# EAGLE board quantum_AnalougeEngine_V3_0 (EAGLE 9.5.1)
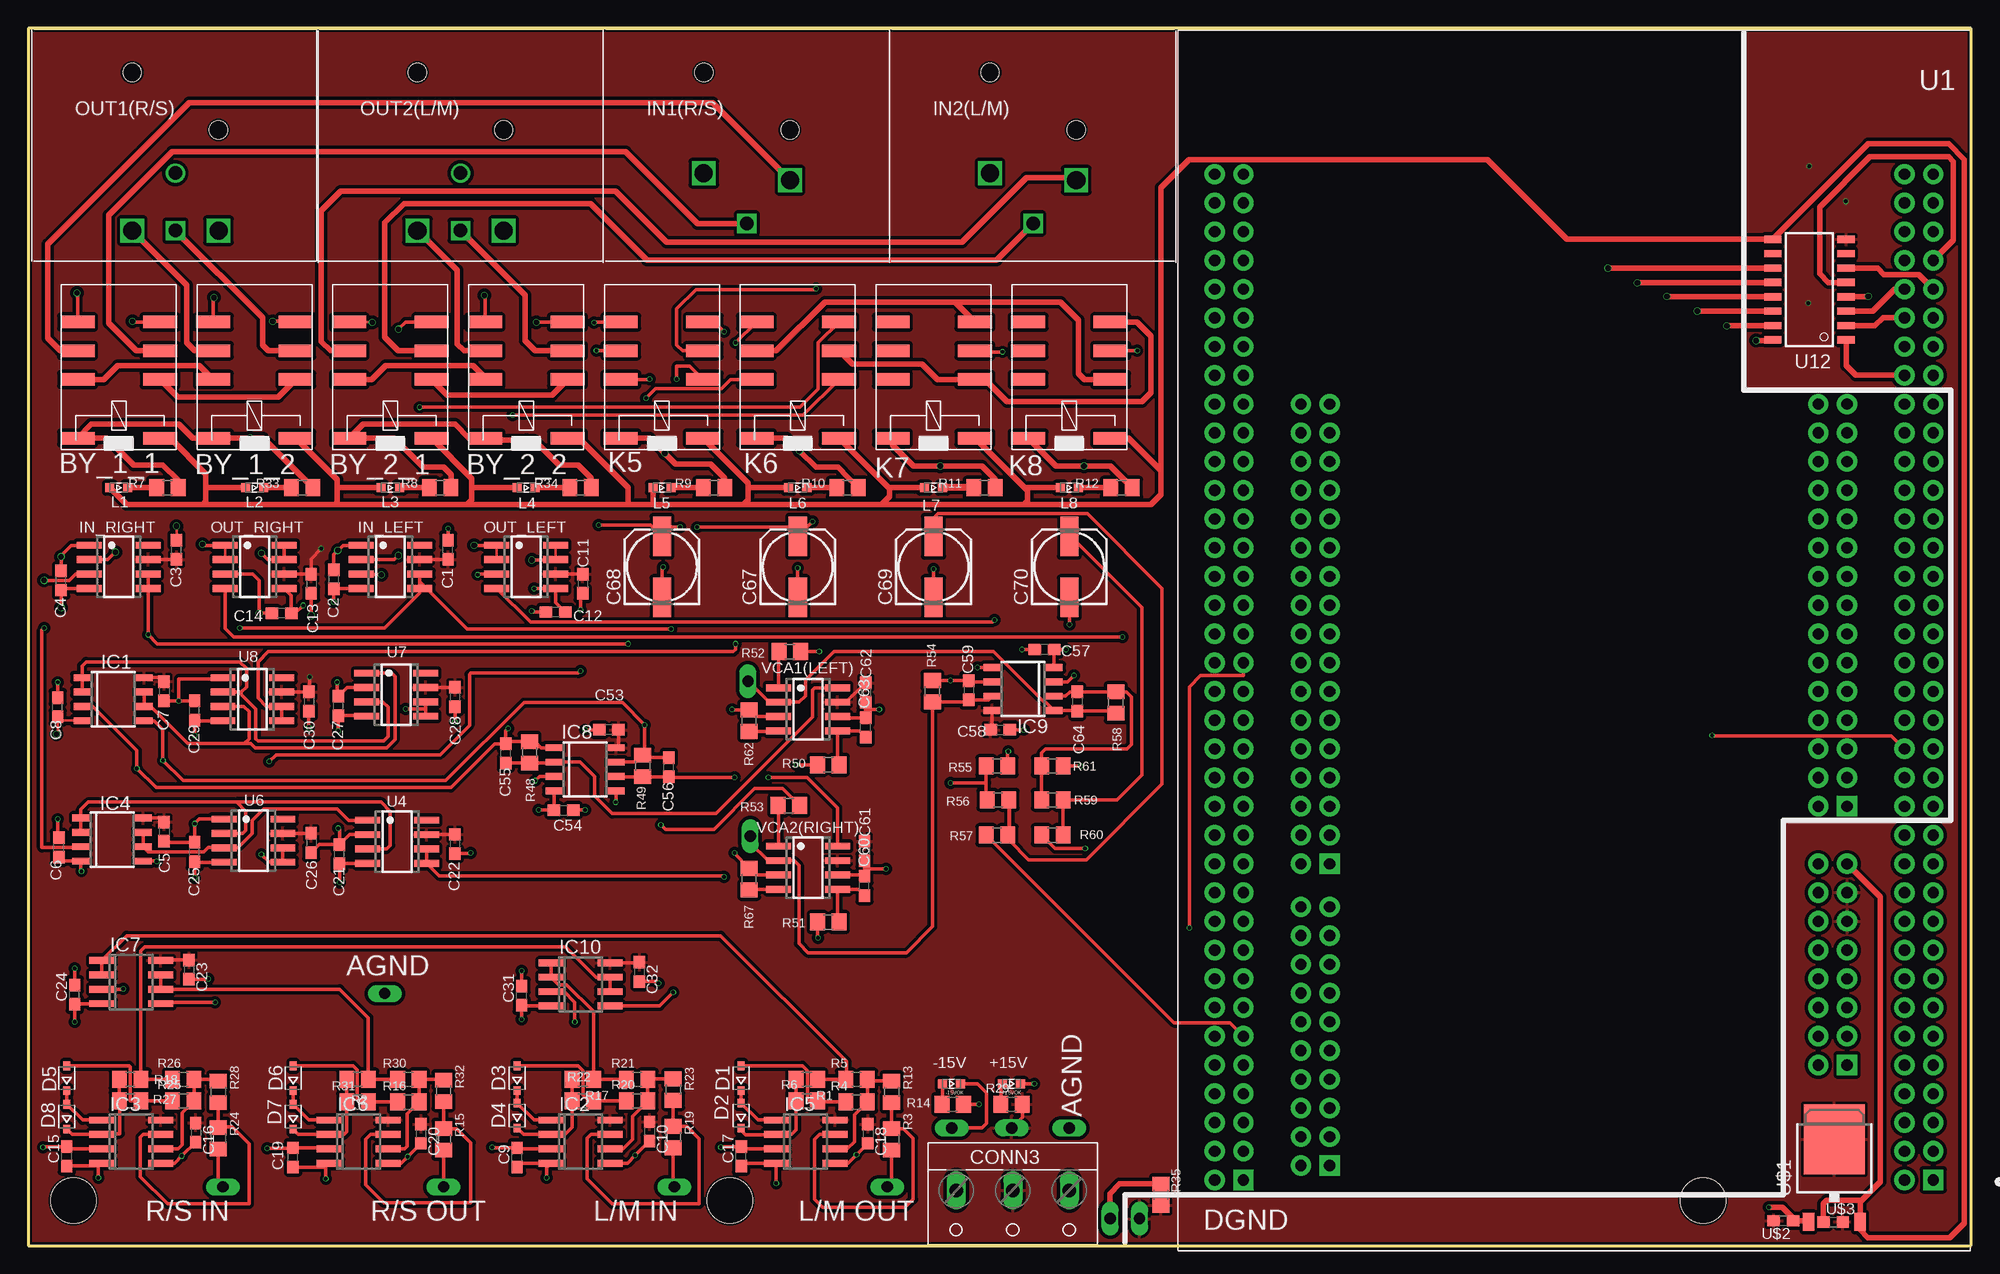
[diagram p10: board, top side]
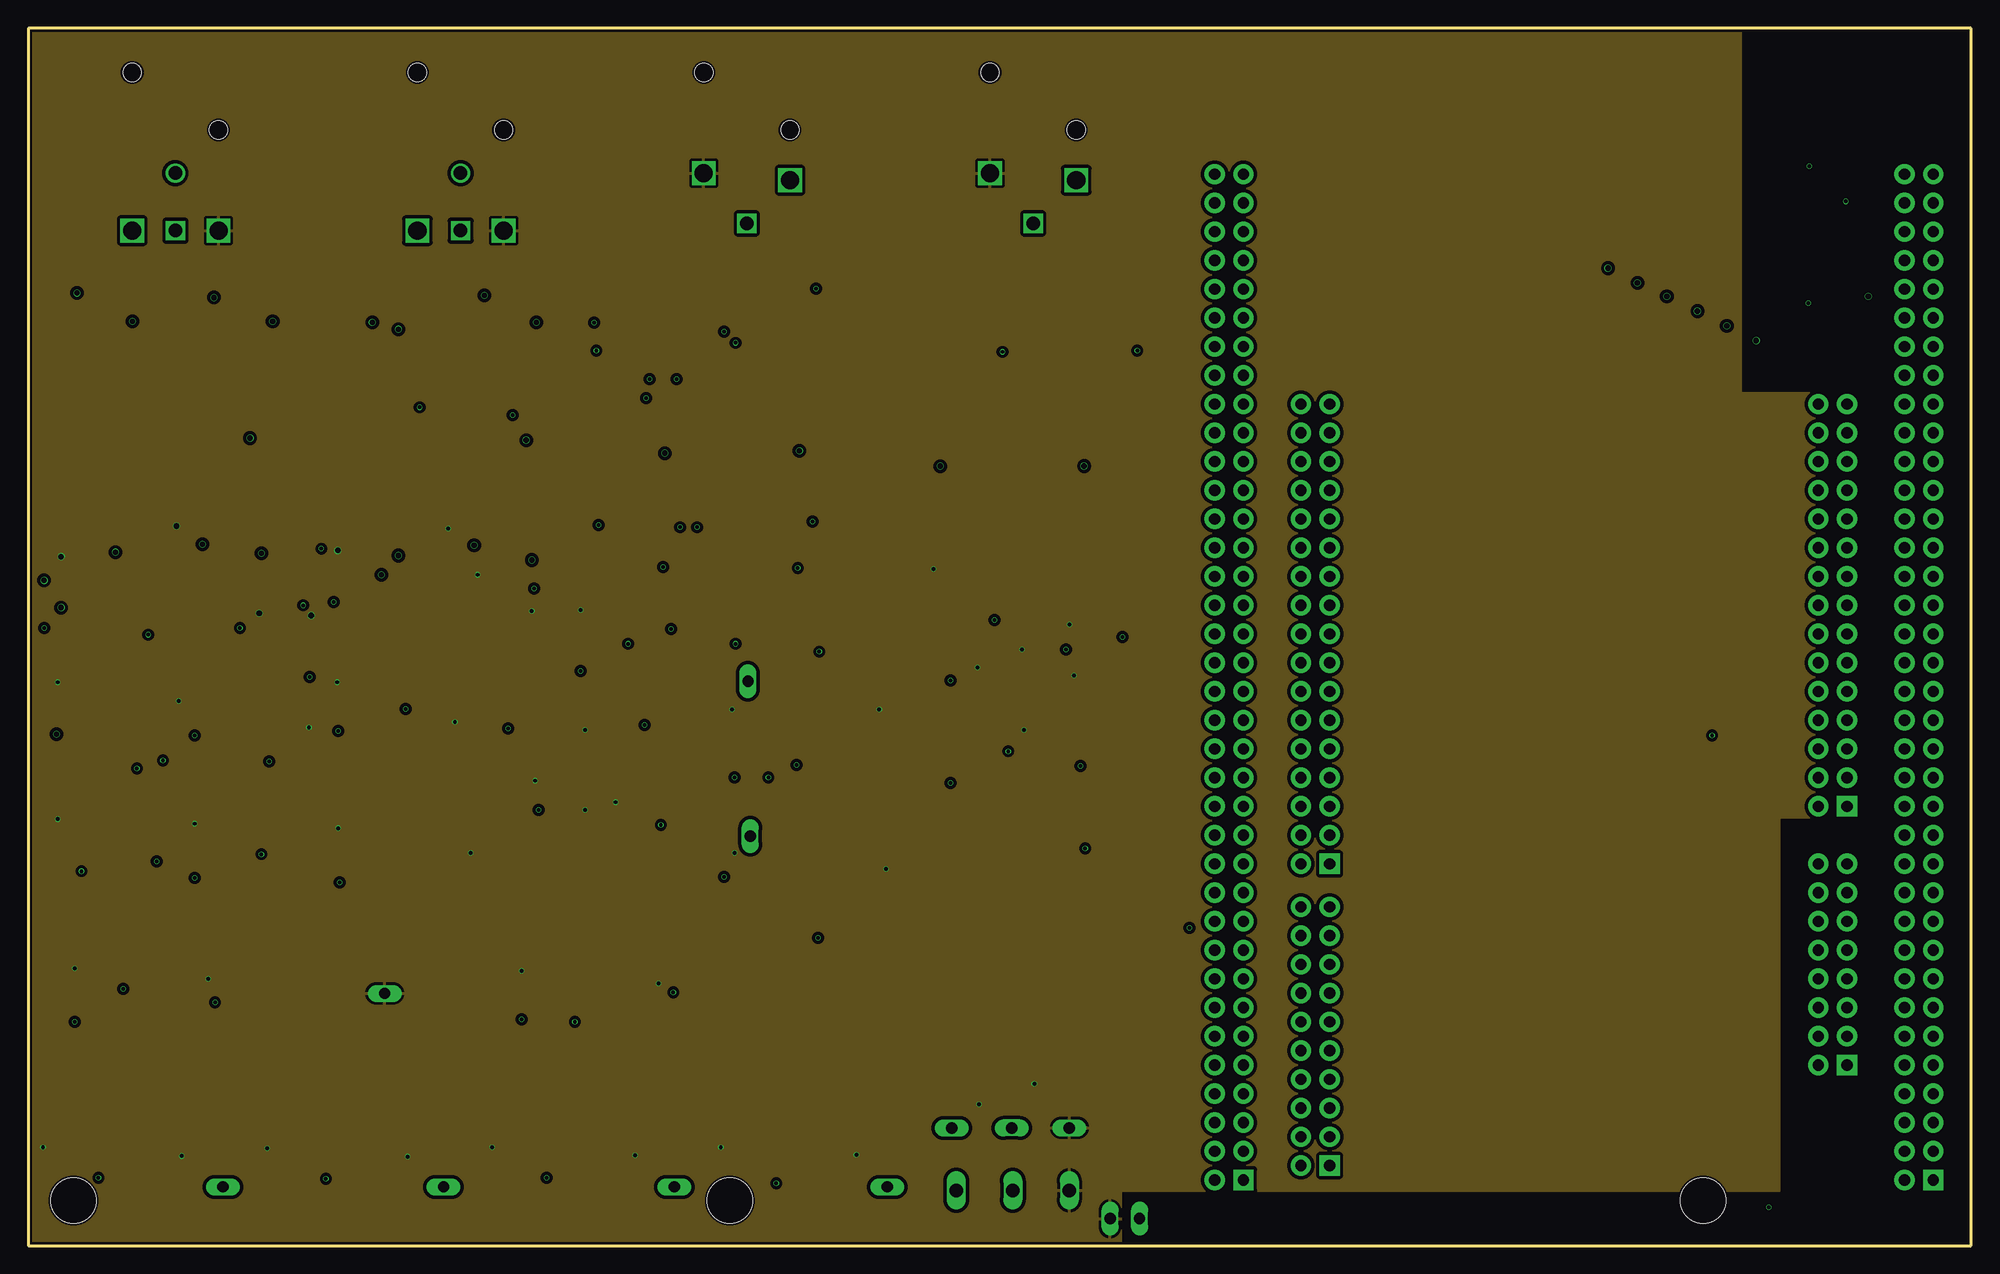
[diagram p11: board, inner layer midTop]
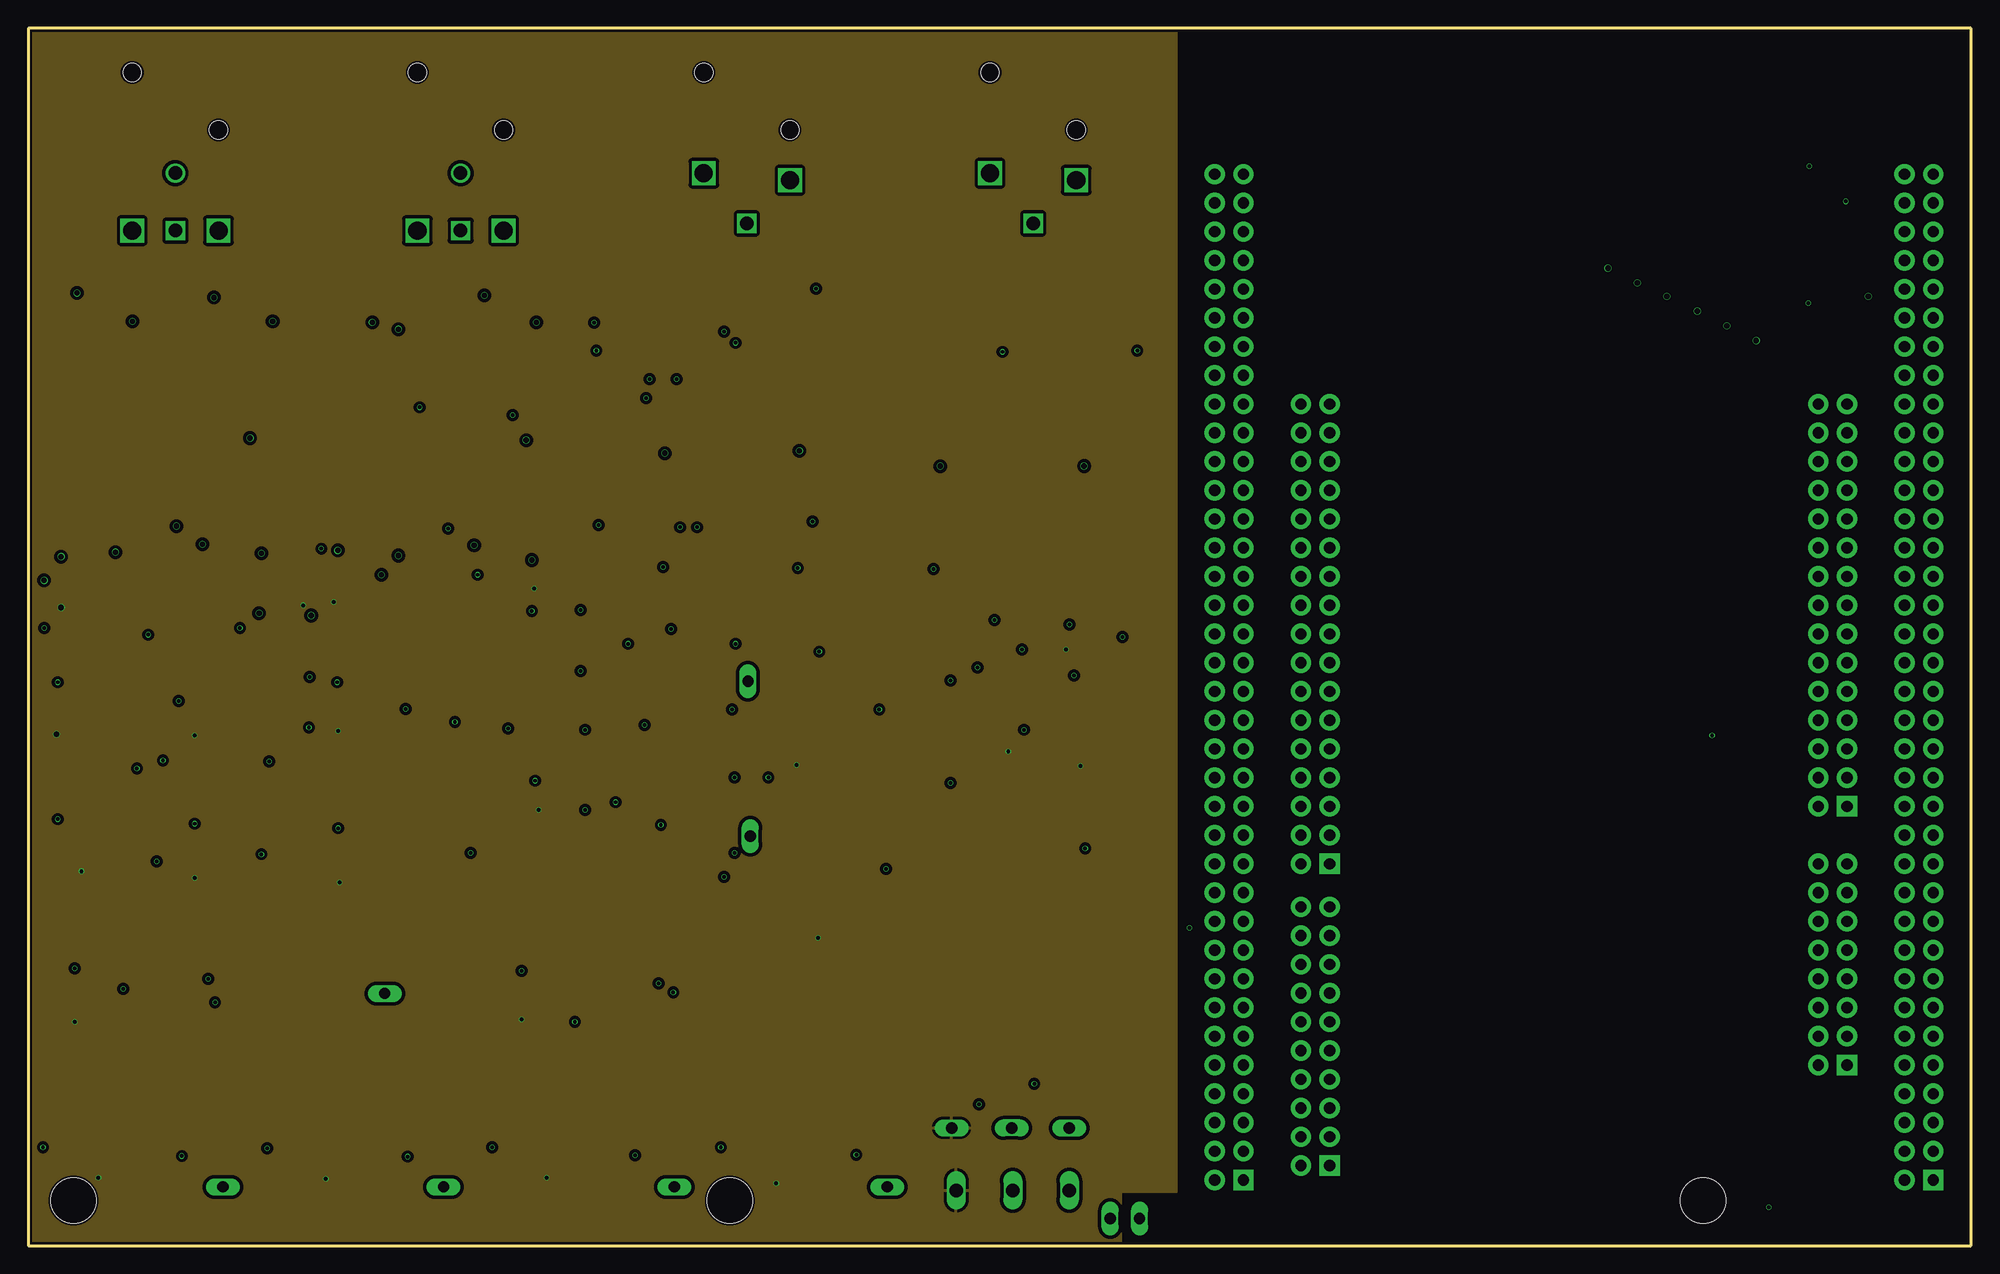
[diagram p12: board, inner layer midBottom]
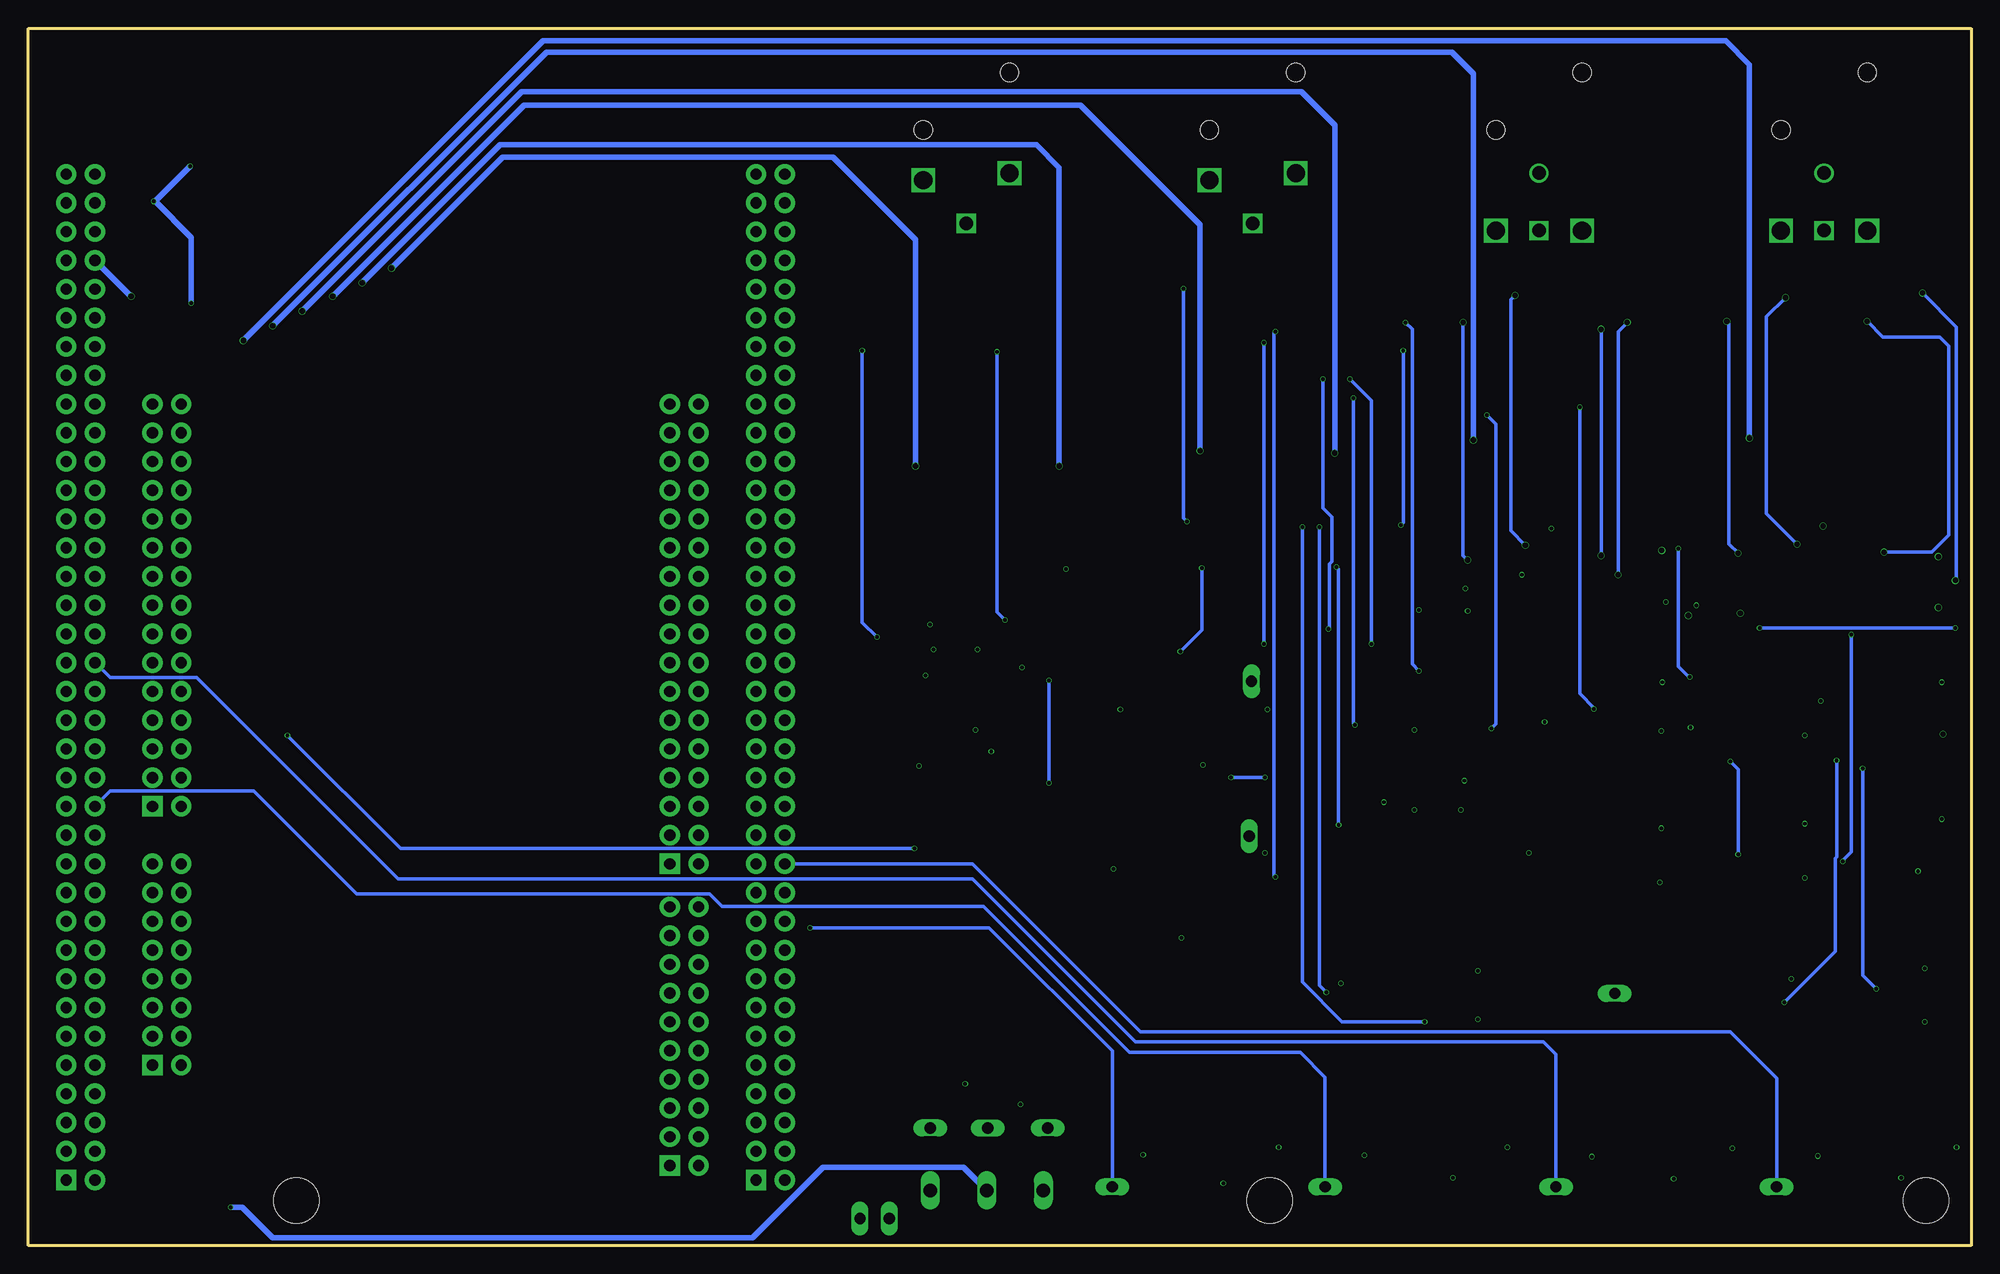
[diagram p13: board, bottom side, seen from below]

Size 171.7 x 107.6 mm. Coordinates in mm from the lower left corner, seen from the top.
Outline: 0,0 171.7,0 171.7,107.6 0,107.6 0,0
Copper layers (1*2+15*16): Top 0.018mm / dielectric 0.362mm / midTop 0.035mm / dielectric 0.71mm / midBottom 0.035mm / dielectric 0.362mm / Bottom 0.018mm
Design rules "4layer *": minimum track width 0.2mm, minimum drill 0.2mm, track to track 0.3mm, track to pad 0.1mm, pad to pad 0.1mm, via to via 0.5mm, smd to smd 0.1mm, copper to edge 0.2mm, drill to drill 0.21mm, minimum pad ring 0.25mm, minimum via ring 0.05mm, stop-mask expansion 0.01mm, vias tented up to drill 0mil, thermal gap 10mil
Holes 4 mm at 4,4 62,4 148,4

## Footprints (pad centres in the part's own frame; a part is rotated, then mirrored left to right if it is on the bottom)
WL-SMCW_0603 = smd 0.8 x 0.8: 1 -0.8,0; 2 0.8,0
351 = smd 1.11 x 3: 1 -2.623,-3.645; 2 -2.623,3.645; P1 5.096,-3.645; P2 5.096,3.645; Q1 2.556,-3.645; Q2 2.556,3.645; S1 7.636,-3.645; S2 7.636,3.645
C0603 = smd 1.1 x 1: 1 -0.85,0; 2 0.85,0
153CLV-0605 = smd 3.5 x 1.6: + 2.7,0; - -2.7,0
W237-103 = drill 1.194 long: 1 -5,-1.29; 2 0,-1.29; 3 5,-1.29
SOD323-R = smd 0.762 x 0.6: A 1.1,0; C -1.1,0
SOIC8 = smd 0.6 x 1.5: 1 -1.905,-2.75; 2 -0.635,-2.75; 3 0.635,-2.75; 4 1.905,-2.75; 5 1.905,2.75; 6 0.635,2.75; 7 -0.635,2.75; 8 -1.905,2.75
SO08 = smd 0.6 x 2.2: 1 -1.905,-2.6; 2 -0.635,-2.6; 3 0.635,-2.6; 4 1.905,-2.6; 5 1.905,2.6; 6 0.635,2.6; 7 -0.635,2.6; 8 -1.905,2.6
NEUTRIK_NC3FAH = drill 1.6 square: 1 -3.81,-12.7; 2 3.81,-13.335 | drill 1.2 square: 3 0,-17.15 | hole 1.6: -3.81,-3.81; 3.81,-8.89
NEUTRIK_NC3MAH = drill 1.6 square: 1 3.81,-17.78; 2 -3.81,-17.78 | drill 1.2 square: 3 0,-17.78 | drill 1.2: G 0,-12.7 | hole 1.6: -3.81,-3.8; 3.81,-8.89
R0805 = smd 1.3 x 1.5: 1 -0.95,0; 2 0.95,0
THT_PIN = drill 1 long: P$1 0,0
MODULE_NUCLEO-F429ZI = drill 1 pad 1.8 square: CN7_1 21.59,43.82; CN8_1 -24.13,34.93; CN9_1 -24.13,12.07; CN10_1 21.59,17.15; CN11_1 -31.75,45.09; CN12_1 29.21,45.09 | drill 1 pad 1.8: CN7_2 24.13,43.82; CN7_3 21.59,41.28; CN7_4 24.13,41.28; CN7_5 21.59,38.74; CN7_6 24.13,38.74; CN7_7 21.59,36.2; CN7_8 24.13,36.2; CN7_9 21.59,33.66; CN7_10 24.13,33.66; CN7_11 21.59,31.12; CN7_12 24.13,31.12; CN7_13 21.59,28.58; CN7_14 24.13,28.58; CN7_15 21.59,26.04; CN7_16 24.13,26.04; CN7_17 21.59,23.5; CN7_18 24.13,23.5; CN7_19 21.59,20.96; CN7_20 24.13,20.96; CN8_2 -21.59,34.93; CN8_3 -24.13,32.39; CN8_4 -21.59,32.39; CN8_5 -24.13,29.85; CN8_6 -21.59,29.85; CN8_7 -24.13,27.31; CN8_8 -21.59,27.31; CN8_9 -24.13,24.77; CN8_10 -21.59,24.77; CN8_11 -24.13,22.23; CN8_12 -21.59,22.23; CN8_13 -24.13,19.69; CN8_14 -21.59,19.69; CN8_15 -24.13,17.15; CN8_16 -21.59,17.15; CN9_2 -21.59,12.07; CN9_3 -24.13,9.53; CN9_4 -21.59,9.53; CN9_5 -24.13,6.99; CN9_6 -21.59,6.99; CN9_7 -24.13,4.45; CN9_8 -21.59,4.45; CN9_9 -24.13,1.91; CN9_10 -21.59,1.91; CN9_11 -24.13,-0.63; CN9_12 -21.59,-0.63; CN9_13 -24.13,-3.17; CN9_14 -21.59,-3.17; CN9_15 -24.13,-5.71; CN9_16 -21.59,-5.71; CN9_17 -24.13,-8.25; CN9_18 -21.59,-8.25; CN9_19 -24.13,-10.79; CN9_20 -21.59,-10.79; CN9_21 -24.13,-13.33; CN9_22 -21.59,-13.33; CN9_23 -24.13,-15.87; CN9_24 -21.59,-15.87; CN9_25 -24.13,-18.41; CN9_26 -21.59,-18.41; CN9_27 -24.13,-20.95; CN9_28 -21.59,-20.95; CN9_29 -24.13,-23.49; CN9_30 -21.59,-23.49; CN10_2 24.13,17.15; CN10_3 21.59,14.61; CN10_4 24.13,14.61; CN10_5 21.59,12.07; CN10_6 24.13,12.07; CN10_7 21.59,9.53; CN10_8 24.13,9.53; CN10_9 21.59,6.99; CN10_10 24.13,6.99; CN10_11 21.59,4.45; CN10_12 24.13,4.45; CN10_13 21.59,1.91; CN10_14 24.13,1.91; CN10_15 21.59,-0.63; CN10_16 24.13,-0.63; CN10_17 21.59,-3.17; CN10_18 24.13,-3.17; CN10_19 21.59,-5.71; CN10_20 24.13,-5.71; CN10_21 21.59,-8.25; CN10_22 24.13,-8.25; CN10_23 21.59,-10.79; CN10_24 24.13,-10.79; CN10_25 21.59,-13.33; CN10_26 24.13,-13.33; CN10_27 21.59,-15.87; CN10_28 24.13,-15.87; CN10_29 21.59,-18.41; CN10_30 24.13,-18.41; CN10_31 21.59,-20.95; CN10_32 24.13,-20.95; CN10_33 21.59,-23.49; CN10_34 24.13,-23.49; CN11_2 -29.21,45.09; CN11_3 -31.75,42.55; CN11_4 -29.21,42.55; CN11_5 -31.75,40.01; CN11_6 -29.21,40.01; CN11_7 -31.75,37.47; CN11_8 -29.21,37.47; CN11_9 -31.75,34.93; CN11_10 -29.21,34.93; CN11_11 -31.75,32.39; CN11_12 -29.21,32.39; CN11_13 -31.75,29.85; CN11_14 -29.21,29.85; CN11_15 -31.75,27.31; CN11_16 -29.21,27.31; CN11_17 -31.75,24.77; CN11_18 -29.21,24.77; CN11_19 -31.75,22.23; CN11_20 -29.21,22.23; CN11_21 -31.75,19.69; CN11_22 -29.21,19.69; CN11_23 -31.75,17.15; CN11_24 -29.21,17.15; CN11_25 -31.75,14.61; CN11_26 -29.21,14.61; CN11_27 -31.75,12.07; CN11_28 -29.21,12.07; CN11_29 -31.75,9.53; CN11_30 -29.21,9.53; CN11_31 -31.75,6.99; CN11_32 -29.21,6.99; CN11_33 -31.75,4.45; CN11_34 -29.21,4.45; CN11_35 -31.75,1.91; CN11_36 -29.21,1.91; CN11_37 -31.75,-0.63; CN11_38 -29.21,-0.63; CN11_39 -31.75,-3.17; CN11_40 -29.21,-3.17; CN11_41 -31.75,-5.71; CN11_42 -29.21,-5.71; CN11_43 -31.75,-8.25; CN11_44 -29.21,-8.25; CN11_45 -31.75,-10.79; CN11_46 -29.21,-10.79; CN11_47 -31.75,-13.33; CN11_48 -29.21,-13.33; CN11_49 -31.75,-15.87; CN11_50 -29.21,-15.87; CN11_51 -31.75,-18.41; CN11_52 -29.21,-18.41; CN11_53 -31.75,-20.95; CN11_54 -29.21,-20.95; CN11_55 -31.75,-23.49; CN11_56 -29.21,-23.49; CN11_57 -31.75,-26.03; CN11_58 -29.21,-26.03; CN11_59 -31.75,-28.57; CN11_60 -29.21,-28.57; CN11_61 -31.75,-31.11; CN11_62 -29.21,-31.11; CN11_63 -31.75,-33.65; CN11_64 -29.21,-33.65; CN11_65 -31.75,-36.19; CN11_66 -29.21,-36.19; CN11_67 -31.75,-38.73; CN11_68 -29.21,-38.73; CN11_69 -31.75,-41.27; CN11_70 -29.21,-41.27; CN11_71 -31.75,-43.81; CN11_72 -29.21,-43.81; CN12_2 31.75,45.09; CN12_3 29.21,42.55; CN12_4 31.75,42.55; CN12_5 29.21,40.01; CN12_6 31.75,40.01; CN12_7 29.21,37.47; CN12_8 31.75,37.47; CN12_9 29.21,34.93; CN12_10 31.75,34.93; CN12_11 29.21,32.39; CN12_12 31.75,32.39; CN12_13 29.21,29.85; CN12_14 31.75,29.85; CN12_15 29.21,27.31; CN12_16 31.75,27.31; CN12_17 29.21,24.77; CN12_18 31.75,24.77; CN12_19 29.21,22.23; CN12_20 31.75,22.23; CN12_21 29.21,19.69; CN12_22 31.75,19.69; CN12_23 29.21,17.15; CN12_24 31.75,17.15; CN12_25 29.21,14.61; CN12_26 31.75,14.61; CN12_27 29.21,12.07; CN12_28 31.75,12.07; CN12_29 29.21,9.53; CN12_30 31.75,9.53; CN12_31 29.21,6.99; CN12_32 31.75,6.99; CN12_33 29.21,4.45; CN12_34 31.75,4.45; CN12_35 29.21,1.91; CN12_36 31.75,1.91; CN12_37 29.21,-0.63; CN12_38 31.75,-0.63; CN12_39 29.21,-3.17; CN12_40 31.75,-3.17; CN12_41 29.21,-5.71; CN12_42 31.75,-5.71; CN12_43 29.21,-8.25; CN12_44 31.75,-8.25; CN12_45 29.21,-10.79; CN12_46 31.75,-10.79; CN12_47 29.21,-13.33; CN12_48 31.75,-13.33; CN12_49 29.21,-15.87; CN12_50 31.75,-15.87; CN12_51 29.21,-18.41; CN12_52 31.75,-18.41; CN12_53 29.21,-20.95; CN12_54 31.75,-20.95; CN12_55 29.21,-23.49; CN12_56 31.75,-23.49; CN12_57 29.21,-26.03; CN12_58 31.75,-26.03; CN12_59 29.21,-28.57; CN12_60 31.75,-28.57; CN12_61 29.21,-31.11; CN12_62 31.75,-31.11; CN12_63 29.21,-33.65; CN12_64 31.75,-33.65; CN12_65 29.21,-36.19; CN12_66 31.75,-36.19; CN12_67 29.21,-38.73; CN12_68 31.75,-38.73; CN12_69 29.21,-41.27; CN12_70 31.75,-41.27; CN12_71 29.21,-43.81; CN12_72 31.75,-43.81
SOIC16 = smd 1.524 x 0.635: 1 -3.24,4.445; 2 -3.24,3.175; 3 -3.24,1.905; 4 -3.24,0.635; 5 -3.24,-0.635; 6 -3.24,-1.905; 7 -3.24,-3.175; 8 -3.24,-4.445; 9 3.24,-4.445; 10 3.24,-3.175; 11 3.24,-1.905; 12 3.24,-0.635; 13 3.24,0.635; 14 3.24,1.905; 15 3.24,3.175; 16 3.24,4.445
TO252 = smd 1 x 1.6: 1 -2.28,-4.8; 3 2.28,-4.8 | smd 5.4 x 6.2: 2 0,2.5

## Placement (x,y rotation side)
+15VOK  SMD_LED_0603  [WL-SMCW_0603]  86.9,14.3 180 top
-15VOK  SMD_LED_0603  [WL-SMCW_0603]  81.6,14.3 180 top
BY_1_1  RELAY_EE2-5NU  [351]  8,74 90 top
BY_1_2  RELAY_EE2-5NU  [351]  20,74 90 top
BY_2_1  RELAY_EE2-5NU  [351]  32,74 90 top
BY_2_2  RELAY_EE2-5NU  [351]  44,74 90 top
C1  100nF  [C0603]  37.1,61.5 90 top
C2  100nF  [C0603]  27,58.9 90 top
C3  100nF  [C0603]  13.1,61.5 90 top
C4  100nF  [C0603]  2.9,58.8 90 top
C5  100nF  [C0603]  12,36.6 270 top
C6  100nF  [C0603]  2.7,35.2 90 top
C7  100nF  [C0603]  12,49 270 top
C8  100nF  [C0603]  2.6,47.6 90 top
C9  100nF  [C0603]  43.2,7.8 90 top
C10  100nF  [C0603]  54.9,10.1 270 top
C11  100nF  [C0603]  49,58.5 270 top
C12  100nF  [C0603]  46.6,56 180 top
C13  100nF  [C0603]  25,58.5 270 top
C14  100nF  [C0603]  22.4,55.9 180 top
C15  100nF  [C0603]  3.4,7.9 90 top
C16  100nF  [C0603]  14.8,10 270 top
C17  100nF  [C0603]  63,7.9 90 top
C18  100nF  [C0603]  74.2,9.9 270 top
C19  100nF  [C0603]  23.4,7.8 90 top
C20  100nF  [C0603]  34.7,9.9 270 top
C21  100nF  [C0603]  27.5,34.6 90 top
C22  100nF  [C0603]  37.7,35.5 270 top
C23  100nF  [C0603]  14.2,24.4 270 top
C24  100nF  [C0603]  4.1,22.2 90 top
C25  100nF  [C0603]  14.7,34.8 90 top
C26  100nF  [C0603]  25,35.6 270 top
C27  100nF  [C0603]  27.4,47.7 90 top
C28  100nF  [C0603]  37.7,48.5 270 top
C29  100nF  [C0603]  14.7,47.3 90 top
C30  100nF  [C0603]  24.8,48.1 270 top
C31  100nF  [C0603]  43.6,22.1 90 top
C32  100nF  [C0603]  54,24.2 270 top
C53  100nF  [C0603]  51.3,45.6 180 top
C54  100nF  [C0603]  47.3,38.5 0 top
C55  22pF  [C0603]  42.2,43.5 90 top
C56  22pF  [C0603]  56.6,42.3 90 top
C57  100nF  [C0603]  89.8,52.7 180 top
C58  100nF  [C0603]  85.9,45.6 0 top
C59  100nF  [C0603]  83.1,49.1 270 top
C60  100nF  [C0603]  73.9,31.8 90 top
C61  100nF  [C0603]  73.9,34.9 270 top
C62  100nF  [C0603]  74,48.9 270 top
C63  100nF  [C0603]  74,45.8 90 top
C64  100nF  [C0603]  92.7,48.1 270 top
C67  47µF  [153CLV-0605]  68,60 90 top
C68  47µF  [153CLV-0605]  56,60 90 top
C69  2.2µF  [153CLV-0605]  80,60 90 top
C70  2.2µF  [153CLV-0605]  92,60 90 top
CONN3  [W237-103]  87,3.6 180 top
D1  4148  [SOD323-R]  63,14.8 90 top
D2  4148  [SOD323-R]  63,11.5 90 top
D3  4148  [SOD323-R]  43.2,14.8 90 top
D4  4148  [SOD323-R]  43.2,11.5 90 top
D5  4148  [SOD323-R]  3.4,14.8 90 top
D6  4148  [SOD323-R]  23.4,14.8 90 top
D7  4148  [SOD323-R]  23.4,11.4 90 top
D8  4148  [SOD323-R]  3.4,11.4 90 top
IC1  OP275  [SOIC8]  7.5,48.3 270 top
IC2  NE5532D  [SO08]  48.8,9.2 270 top
IC3  NE5532D  [SO08]  9.1,9.2 270 top
IC4  OP275  [SOIC8]  7.4,35.9 270 top
IC5  NE5532D  [SO08]  68.7,9.2 270 top
IC6  NE5532D  [SO08]  29.2,9.2 270 top
IC7  NE5532D  [SO08]  9.1,23.3 270 top
IC8  OP275  [SOIC8]  49.2,42.1 270 top
IC9  TL072  [SOIC8]  87.9,49.2 90 top
IC10  NE5532D  [SO08]  48.8,23.1 270 top
IN1(R/S)  NEUTRIK_NC3FAH  [NEUTRIK_NC3FAH]  63.5,107.5 0 top
IN2(L/M)  NEUTRIK_NC3FAH  [NEUTRIK_NC3FAH]  88.8,107.5 0 top
IN_LEFT  1240  [SO08]  32,60 270 top
IN_RIGHT  1240  [SO08]  8,60 270 top
K5  RELAY_EE2-5NU  [351]  56,74 90 top
K6  RELAY_EE2-5NU  [351]  68,74 90 top
K7  RELAY_EE2-5NU  [351]  80,74 90 top
K8  RELAY_EE2-5NU  [351]  92,74 90 top
L1  SMD_LED_0603  [WL-SMCW_0603]  8,67 180 top
L2  SMD_LED_0603  [WL-SMCW_0603]  20,67 180 top
L3  SMD_LED_0603  [WL-SMCW_0603]  32,67 180 top
L4  SMD_LED_0603  [WL-SMCW_0603]  44,67 180 top
L5  SMD_LED_0603  [WL-SMCW_0603]  56,67 180 top
L6  SMD_LED_0603  [WL-SMCW_0603]  68,67 180 top
L7  SMD_LED_0603  [WL-SMCW_0603]  80,67 180 top
L8  SMD_LED_0603  [WL-SMCW_0603]  92,67 180 top
OUT1(R/S)  NEUTRIK_NC3MAH  [NEUTRIK_NC3MAH]  13,107.5 0 top
OUT2(L/M)  NEUTRIK_NC3MAH  [NEUTRIK_NC3MAH]  38.2,107.5 0 top
OUT_LEFT  1646  [SO08]  44,60 270 top
OUT_RIGHT  1646  [SO08]  20,60 270 top
R1  100k  [R0805]  68.8,14.7 180 top
R2  100k  [R0805]  29.1,14.7 180 top
R3  0R  [R0805]  76.3,9.4 270 top
R4  100k  [R0805]  73.2,12.7 0 top
R5  180k  [R0805]  73.2,14.7 0 top
R6  100k  [R0805]  68.8,12.8 0 top
R7  500R  [R0805]  12.3,67 180 top
R8  500R  [R0805]  36.4,67 180 top
R9  500R  [R0805]  60.6,67 180 top
R10  500R  [R0805]  72.4,67 180 top
R11  500R  [R0805]  84.5,67 180 top
R12  500R  [R0805]  96.6,67 180 top
R13  100k  [R0805]  76.3,13.6 270 top
R14  0R  [R0805]  81.7,12.5 0 top
R15  0R  [R0805]  36.7,9.4 270 top
R16  100k  [R0805]  33.6,12.7 0 top
R17  100k  [R0805]  49,14.7 180 top
R18  100k  [R0805]  9,14.7 180 top
R19  0R  [R0805]  57,9.6 270 top
R20  100k  [R0805]  53.8,12.8 0 top
R21  180k  [R0805]  53.8,14.7 0 top
R22  100k  [R0805]  49,12.8 0 top
R23  100k  [R0805]  57,13.8 270 top
R24  0R  [R0805]  16.8,9.5 270 top
R25  100k  [R0805]  13.7,12.8 0 top
R26  180k  [R0805]  13.7,14.7 0 top
R27  100k  [R0805]  9,12.8 0 top
R28  100k  [R0805]  16.8,13.6 270 top
R29  0R  [R0805]  86.9,12.5 0 top
R30  180k  [R0805]  33.6,14.7 0 top
R31  100k  [R0805]  29.1,12.7 0 top
R32  100k  [R0805]  36.7,13.7 270 top
R33  500R  [R0805]  24.2,67 180 top
R34  500R  [R0805]  48.8,67 180 top
R35  0R  [R0805]  100.1,4.5 270 top
R48  20k  [R0805]  44.3,43.6 90 top
R49  20k  [R0805]  54.3,42.4 90 top
R50  5k1  [R0805]  70.7,42.5 0 top
R51  5k1  [R0805]  70.7,28.6 0 top
R52  20k  [R0805]  67.3,52.5 180 top
R53  20k  [R0805]  67.2,38.9 180 top
R54  2k00  [R0805]  79.9,49 270 top
R55  178k  [R0805]  85.6,42.4 180 top
R56  6k49  [R0805]  85.7,39.4 180 top
R57  6k34  [R0805]  85.6,36.3 0 top
R58  2k00  [R0805]  96.1,48 270 top
R59  6k49  [R0805]  90.5,39.4 180 top
R60  6k34  [R0805]  90.5,36.3 0 top
R61  178k  [R0805]  90.5,42.4 180 top
R62  51R  [R0805]  63.7,46.4 90 top
R67  51R  [R0805]  63.7,32.4 90 top
TP01  TPTHT  [THT_PIN]  57.1,5.2 0 top
TP02  TPTHT  [THT_PIN]  17.2,5.2 0 top
TP03  TPTHT  [THT_PIN]  75.9,5.2 0 top
TP04  TPTHT  [THT_PIN]  36.7,5.2 0 top
TP05  TPTHT  [THT_PIN]  98.2,2.4 90 top
TP06  TPTHT  [THT_PIN]  92,10.4 0 top
TP09  TPTHT  [THT_PIN]  86.9,10.4 180 top
TP16  TPTHT  [THT_PIN]  31.5,22.3 0 top
TP18  TPTHT  [THT_PIN]  95.6,2.4 90 top
TP23  TPTHT  [THT_PIN]  81.6,10.4 0 top
TP36  TPTHT  [THT_PIN]  63.8,36.2 90 top
TP37  TPTHT  [THT_PIN]  63.6,49.9 90 top
U1  NUCLEO-F429ZI  [MODULE_NUCLEO-F429ZI]  136.6,50.9 180 top
U4  THAT1240  [SO08]  32.6,35.7 270 top
U6  THAT1240  [SO08]  19.9,35.8 270 top
U7  THAT1240  [SO08]  32.5,48.7 270 top
U8  THAT1240  [SO08]  19.8,48.3 270 top
U12  ULN2003  [SOIC16]  157.4,84.5 180 top
U$1  7809  [TO252]  159.6,6.9 0 top
U$2  [C0603]  155.1,2.2 180 top
U$3  [C0603]  159.5,2.1 0 top
VCA1(LEFT)  THAT2181S  [SO08]  68.9,47.4 270 top
VCA2(RIGHT)  THAT2181S  [SO08]  68.9,33.4 270 top

## Tracks (layer width: path | path; a pad name or v marks a point on that pad's centre or on a via)
+9V
  Top 0.508: L1.2 8.7,65.5 15.4,65.5 | 15.4,65.5 15.7,65.8 15.7,67.1 | 15.7,67.1 15.7,68.2 12.52,71.38 BY_1_1.1 | L2.2 15.8,67 15.7,67.1 | BY_1_2.1 27.3,67.72 27.3,67 | 27.3,67 27.3,65.7 27.1,65.5 | 27.1,65.5 15.4,65.5 | L3.2 27.3,67 | 27.1,65.5 38.8,65.5 | 38.8,65.5 39.2,65.9 39.2,67 | 39.2,67 39.2,67.82 BY_2_1.1 | L4.2 39.2,67 | 38.8,65.5 53,65.5 | 53,65.5 55.2,65.5 | 55.2,65.5 63.2,65.5 | BY_2_2.1 48.65,71.38 53.02,67 53.02,65.52 53,65.5 | 63.2,65.5 63.6,65.9 63.6,67.1 | 63.6,67.1 63.6,67.42 K5.1 | L6.2 63.7,67 63.6,67.1 | 63.2,65.5 75.4,65.5 | 75.4,65.5 88,65.5 | 88,65.5 88.3,65.8 88.3,66.72 88.02,67 | 88.02,67 K7.1 | L8.2 88.02,67 | 88,65.5 99.2,65.5 100.1,66.4 100.1,68.5 | K8.1 97.22,71.38 100.1,68.5 | U$1.3 161.88,1.4 162.58,0.7 169.8,0.7 171.1,2 171.1,96 169.7,97.4 162.62,97.4 U12.9 135.96,88.94 128.94,95.96 102.56,95.96 100.1,93.5 100.1,68.5 | U$1.3 161.88,4 158.95,4 158.65,3.7 U$3.1 | U1.CN8_15 163.65,30.83 163.65,5.67 161.88,3.9 U$1.3 | L7.2 76.1,67 | 76.1,67 76.02,67 K6.1 | 76.1,67 76.1,66.2 75.4,65.5 | L5.2 55.2,65.5
ADC1-IN0
  Top 0.305: R19.2 57,5.3 TP01.P$1
  Bottom 0.305: TP01.P$1 57.1,14.9 59.3,17.1 74.4,17.1 87.3,30 110.4,30 111.49,31.09 142.69,31.09 151.8,40.2 164.44,40.2 U1.CN11_28
ADC1-IN3  (via drill 0.35)
  Top 0.305: R3.2 76.3,5.6 TP03.P$1 | v102.6,28.1 102.6,49.4 103.58,50.38 107.39,50.38 U1.CN12_37
  Bottom 0.305: TP03.P$1 75.9,17.2 86.8,28.1 v102.6,28.1
ADC2-IN9
  Top 0.305: TP02.P$1 16.8,5.6 R24.2
  Bottom 0.305: TP02.P$1 17.2,14.8 21.3,18.9 73.4,18.9 88.25,33.75 U1.CN12_24
ADC2-IN10
  Top 0.305: R15.2 TP04.P$1
  Bottom 0.305: TP04.P$1 36.7,16.9 37.8,18 73.85,18 85.48,29.62 85.58,29.72 88.25,32.4 139,32.4 156.8,50.2 164.48,50.2 U1.CN11_38
AGND  (via drill 0.35, 0.5)
  Top 0.203: 2.9,61 v2.9,60.9 | C3.2 v13.1,63.6
  Top 0.305: C4.2 v2.9,60.9 | IN_RIGHT.1 3.81,61.91 2.9,61 | C2.2 27,61.1 v27.35,61.45 27.8,61.91 IN_LEFT.1 | OUT_RIGHT.3 19.84,59.37 20.4,58.8 v20.4,55.9 C14.2 | C13.2 v25,55.7 | C1.2 v37.1,63.4 | OUT_LEFT.3 39.77,59.37 v39.7,59.3 | C11.2 48.8,57.45 v48.8,56.2 | C12.2 44.6,56 v44.5,56.1 | VCA1(LEFT).3 64.28,46.77 R62.2 62.25,47.35 v62.2,47.4 | VCA1(LEFT).6 71.61,46.65 C63.2 74,47.4 | 74,47.4 C62.2 | 74,47.4 v75.2,47.4 | C58.2 v88,45.6 | IC9.3 91.83,49.84 v92.4,50.4 | C57.2 v87.8,52.7 | IC9.5 v83.9,51.1 | C70.- v92,54.9 | C69.- v80,59.8 | IC8.3 45.16,41.47 v44.8,41.1 | C54.2 v49.2,38.5 | IC8.5 51.95,39.25 v51.9,39.2 | C53.2 v49.2,45.6 | C8.2 v2.6,49.8 | C7.2 v13.3,48.15 | v13.3,48.15 C29.2 | U8.1 17.09,50.1 13.3,50.1 v13.3,48.15 | C6.2 2.6,36.15 v2.6,37.7 | U6.1 15.11,37.7 v14.7,37.3 C25.2 12.1,35.65 C5.2 | C30.2 v24.8,45.8 | v27.3,49.8 27.3,48.65 C27.2 28.18,49.34 U7.2 | C28.2 v37.7,46.3 | C21.2 28.39,36.34 U4.2 | C21.2 27.5,36.8 v27.4,36.9 | C22.2 39.05,34.65 v39.1,34.7 | C23.2 15.85,23.55 v15.9,23.6 | C24.2 v4.1,24.5 | C31.2 v43.6,24.3 | C32.2 55.55,23.35 v55.7,23.2 | C26.2 25.7,35.45 C21.2 | VCA2(RIGHT).6 73.78,32.77 C60.2 C61.2 73.9,33.3 v75.8,33.3 | VCA2(RIGHT).3 64.28,32.77 R67.2 62.4,34.65 v62.4,34.7 | IC3.3 3.58,8.56 C15.2 1.35,8.75 v1.3,8.7 | IC3.5 12.95,7.29 v13.57,7.92 C16.2 | IC6.3 26.52,8.65 C19.2 23.35,8.6 v21.1,8.6 | IC6.5 32.95,7.29 v33.52,7.88 C20.2 | IC2.3 43.28,8.56 C9.2 41.05,8.65 v41,8.7 | IC2.5 52.95,7.29 v53.62,7.97 C10.2 | IC5.3 63.19,8.56 C17.2 61.25,8.75 v61.2,8.7 | IC5.5 72.44,7.29 v73.17,8.03 C18.2 | +15VOK.1 v88.9,14.3 | v84,12.5 R14.2
  Top 0.508: R35.1 96.45,5.45 95.6,4.6 TP18.P$1
  pour midTop: 151.4,108.3 151.4,75.4 169.6,75.4 169.6,37.8 154.8,37.8 154.8,4.8 96.6,4.8 96.6,-1 -0.3,-1 -0.3,108.3
DAC_OUT1  (via drill 0.35)
  Top 0.305: R60.1 90.75,35.1 v93.4,35.1 | v148.8,45.1 148.84,45.06 164.66,45.06 U1.CN11_32
  Bottom 0.305: v93.4,35.1 138.8,35.1 v148.8,45.1
DAC_OUT2
  Top 0.305: R57.1 101.25,19.7 106.2,19.7 U1.CN12_11
DGND  (via drill 0.35)
  Bottom 0.508: v157.4,95.4 160.5,92.3 | 160.5,92.3 v160.6,92.3 | v157.3,83.3 157.3,89.1 160.5,92.3
  pour Top: 151.9,108.3 151.9,75.9 170.1,75.9 170.1,37.4 155.3,37.4 155.3,4.3 97.2,4.3 97.2,-1 172.7,-1 172.7,108.3
L  (via drill 0.35)
  Top 0.305: IN_LEFT.6 34.6,58.7 | 34.6,58.7 IN_LEFT.5 34.6,57.7 31.5,54.6 v18.7,54.6 | v57.3,76.6 57.3,77.74 58.46,77.74 K5.Q1 | v56.8,54.5 38.8,54.5 34.6,58.7 | IC4.3 4.58,35.2 1.2,35.2 1.2,54.4 v1.4,54.6
  Bottom 0.305: v57.3,76.6 57.3,65.2 56.5,64.4 56.5,60.45 56.7,60.25 56.7,54.59 v56.8,54.5 | v1.4,54.6 10.35,54.6 v18.7,54.6
L/M_IN(VCA1_IN)  (via drill 0.35)
  Top 0.305: K5.P1 57.8,79.1 57.3,79.6 57.3,82.8 59,84.5 69.6,84.5 v69.6,84.6 | v69.3,64 C67.+ 67.2,63.5 v59.1,63.5 | v48.3,19.8 48.3,21.5 47.34,22.46 IC10.3
  Bottom 0.305: v69.6,84.6 69.6,64.3 v69.3,64 | v59.1,63.5 59.1,23.3 55.6,19.8 v48.3,19.8
L/M_OUT(VCA1_OUT)  (via drill 0.35)
  Top 0.305: K6.Q1 68.49,73.4 v42.8,73.4 | v42.4,45.7 42.2,45.5 C55.2 | C55.2 42.4,44.55 R48.2 44.75,44.55 45.3,44 IC8.1 | IC1.3 5.69,47.66 9.6,43.75 v9.6,42.2 11.3,40.49 37.35,40.49 41.2,44.35 C55.2 | v8.4,22.7 8.37,22.66 IC7.3
  Bottom 0.305: v42.4,45.7 42,46.1 42,72.6 v42.8,73.4 | v9.6,42.2 9.6,23.9 v8.4,22.7
L/M_OUT+  (via drill 0.5)
  Top 0.2: 44.94,81.64 v44.9,81.6 | 46.6,60.6 OUT_LEFT.7 OUT_LEFT.8
  Top 0.305: BY_2_2.S1 44.94,81.64 | 46.6,60.6 v44.5,60.6
  Bottom 0.305: v44.9,81.6 44.9,61 v44.5,60.6
L/M_OUT-  (via drill 0.5)
  Top 0.2: 40.35,83.94 v40.3,84 | v39.4,61.9 v39.41,61.91 | OUT_LEFT.1 OUT_LEFT.2
  Top 0.305: BY_2_2.S2 40.35,83.94 | v39.41,61.91 OUT_LEFT.1
  Bottom 0.305: v40.3,84 40.7,83.6 40.7,63.2 v39.4,61.9
M  (via drill 0.35)
  Top 0.305: K5.S1 60.66,81.64 v61.5,80.8 | U4.6 U4.5 36.3,32.7 61.4,32.7 v61.5,32.6
  Bottom 0.305: v61.5,80.8 61.6,80.7 61.6,53 61.6,52.7 61.6,32.7 v61.5,32.6
M1  (via drill 0.35)
  Top 0.305: K6.S1 69.81,79.8 69.81,75.7 68.21,74.1 v34.6,74.1 | v33.35,47.45 35.1,47.45 U7.6 U7.5
  Bottom 0.305: v34.6,74.1 34.6,48.8 33.3,47.5 v33.35,47.45
N$1  (via drill 0.5)
  Top 0.203: 9.26,81.64 v9.2,81.7
  Top 0.305: BY_1_1.S1 9.26,81.64 | v7.7,61.3 7.04,60.63 IN_RIGHT.2
  Bottom 0.305: v9.2,81.7 7.8,80.3 2.8,80.3 2,79.5 2,62.8 3.5,61.3 v7.7,61.3
N$2  (via drill 0.5)
  Top 0.203: 4.36,84.14 v4.3,84.2
  Top 0.305: BY_1_1.S2 4.36,84.14 | IN_RIGHT.3 4.2,59.37 3.63,58.8 v1.4,58.8
  Bottom 0.305: v4.3,84.2 1.3,81.2 1.3,58.9 v1.4,58.8
N$3
  Top 0.305: D4.C 43.77,9.84 46,9.84 | 46,9.84 IC2.2 | R17.2 R22.1 48.05,10.45 47.4,9.8 46.03,9.8 46,9.84
N$4
  Top 0.305: IC2.1 44.7,11.11 D4.A D3.C
N$5
  Top 0.508: K6.P1 72.84,77.9 79,77.9 80.34,76.56 K7.Q1 84.54,76.56 86.5,74.6 98.4,74.6 99.2,75.4 99.2,80.4 97.96,81.64 K8.S1
N$6
  Top 0.305: D2.C 63,10.2 63.4,9.8 66.06,9.8 IC5.2 67.44,9.84 67.85,10.25 R6.1 R1.2
N$7  (via drill 0.5)
  Top 0.2: BY_2_1.S2 30.36,81.64 v30.4,81.6 | 29.46,59.3 IN_LEFT.3
  Top 0.305: v31.2,59.3 29.46,59.3
  Bottom 0.305: v30.4,81.6 31.2,80.8 v31.2,59.3
N$8
  Top 0.508: BY_1_1.Q1 13.2,75 22.09,75 BY_1_2.Q1
N$9
  Top 0.305: IC5.1 64.5,11.11 D2.A D1.C
N$10
  Top 0.305: D3.A 48.61,15.9 49.05,15.46 49.05,13.3 49.55,12.8 R22.2 R20.1
N$11
  Top 0.508: BY_1_1.Q2 6.66,76.56 7.9,77.8 15.11,77.8 BY_1_2.Q2
N$12
  Top 0.305: D1.A 68.41,15.9 68.85,15.46 68.85,12.95 69,12.8 R6.2 69.85,12.7 R4.1
N$13  (via drill 0.5)
  Top 0.305: BY_2_1.S1 33.34,81.64 v32.7,81 | v32.7,61 32.34,60.63 IN_LEFT.2
  Bottom 0.305: v32.7,81 v32.7,61
N$14
  Top 0.508: R7.2 L1.1
N$15
  Top 0.508: OUT2(L/M).3 43.9,84.02 43.9,80 44.8,79.1 BY_2_2.P1
N$16
  Top 0.508: R8.2 L3.1
N$17
  Top 0.508: OUT2(L/M).2 37.9,86.21 37.9,79.7 38.5,79.1 BY_2_2.P2
N$18
  Top 0.305: IC4.1 IC4.2 4.65,38.55 5.3,39.2 18.4,39.2 | 18.4,39.2 19.2,38.4 19.2,36.7 18.93,36.44 U6.2 | U4.3 31.66,35.06 32,35.4 32,38.4 31.2,39.2 18.4,39.2
N$19
  Top 0.508: K6.P2 66.1,79.1 70.4,83.4 81.88,83.4 | K7.S1 81.88,83.4 | 81.88,83.4 91.2,83.4 92.8,81.8 92.8,77.1 93.34,76.56 K8.Q1
N$20
  Top 0.305: IC2.6 52.56,8.56 53.4,9.4 53.4,11.45 R20.2 R21.2 54.8,14.75 R23.1
N$21
  Top 0.508: BY_1_1.P2 2.8,79.1 1.7,80.2 1.7,88.5 14.2,101 60.48,101 IN1(R/S).2
N$22
  Top 0.508: BY_1_1.P1 9.53,79.1 7.1,81.53 7.1,91.1 12.7,96.7 52.8,96.7 59.15,90.35 IN1(R/S).3
N$23
  Top 0.508: OUT1(R/S).2 14,84.91 14,79.8 14.7,79.1 BY_1_2.P2
N$24
  Top 0.508: OUT1(R/S).3 20.7,82.02 20.7,79.6 21.2,79.1 BY_1_2.P1
N$25
  Top 0.508: BY_2_1.P1 32.7,79.1 31.5,80.3 31.5,90.4 33.2,92.1 49.7,92.1 54.7,87.1 85.55,87.1 IN2(L/M).3
N$26
  Top 0.508: R12.2 L8.1
N$27
  Top 0.508: BY_2_1.P2 26.7,79.1 25.9,79.9 25.9,91.5 27.6,93.2 51.9,93.2 56.4,88.7 82.5,88.7 88.2,94.4 92.38,94.4 IN2(L/M).2
N$28
  Top 0.508: BY_2_1.Q1 37,75.2 46.29,75.2 BY_2_2.Q1
N$29
  Top 0.61: R11.2 L7.1
N$30
  Top 0.508: R10.2 L6.1
N$31
  Top 0.508: BY_2_1.Q2 30.36,76.56 31.6,77.8 39.3,77.8 40.35,76.75 BY_2_2.Q2
N$32
  Top 0.508: R9.2 L5.1
N$33
  Top 0.305: IC4.7 IC4.6 10.62,34.8 15.5,34.8 15.9,35.2 17.27,35.2 U6.3 18.52,35.16 19.8,36.45 19.8,37.6 20.8,38.59 27.3,38.59 28.3,37.6 U4.1
N$34
  Top 0.305: IC5.6 72.36,8.56 73,9.2 73,11.55 R4.2 R5.2 74.3,14.55 R13.1
N$35
  Top 0.305: R23.2 R19.1 58.2,10.55 59.3,9.45 59.3,3.7 51.6,3.7 49.4,5.9 49.4,9.5 49.73,9.84 IC2.7
N$36
  Top 0.305: IC5.7 69.94,9.84 69.5,9.4 69.5,4.1 70.2,3.4 77.5,3.4 78.2,4.1 78.2,9.5 77.35,10.35 R3.1 R13.2
N$37
  Top 0.305: D8.C 3.87,9.84 IC3.2 6.57,9.9 8.1,9.9 8.1,12.75 R27.1 R18.2
N$38
  Top 0.305: D5.C D8.A 4.79,11.11 IC3.1
N$39
  Top 0.305: R25.1 R27.2 9,12.8 9,15.8 8.9,15.9 D5.A
N$40
  Top 0.305: R28.1 16.65,14.7 R26.2 R25.2 13.6,11.75 13.6,8.9 13.27,8.56 IC3.6
N$41
  Top 0.305: R24.1 16.8,10.5 | 16.8,10.5 R28.2 | IC3.7 10.13,9.84 9.9,9.6 9.9,6.1 12.3,3.7 19.5,3.7 19.5,9 18,10.5 16.8,10.5
N$42
  Top 0.305: R2.2 R31.1 28.15,10.05 27.93,9.84 IC6.2 23.86,9.84 D7.C
N$43
  Top 0.305: U8.3 19.04,47.66 19.5,47.2 19.5,44.8 19.1,44.4 | 19.1,44.4 14.1,44.4 10.84,47.66 IC1.6 IC1.7 | 19.1,44.4 19.64,44.4 20.05,43.99 31.65,43.99 32.41,44.75 32.41,47.85 32.4,47.85 32.4,50.3 32.09,50.6 U7.1
N$44
  Top 0.305: IC6.1 24.8,11.11 D7.A D6.C
N$45
  Top 0.305: IC1.1 IC1.2 4.75,51.25 5.1,51.6 18.7,51.6 19.3,51 19.3,49.4 18.84,48.94 | 18.84,48.94 U8.2 | 18.84,48.94 18.84,48.72 20.11,47.45 20.11,44.8 20.3,44.6 31.4,44.6 31.8,45 31.8,47.6 31.34,48.06 U7.3
N$46
  Top 0.305: R16.1 R31.2 29.3,12.7 29.05,12.95 29.05,15.55 28.71,15.9 D6.A
N$47
  Top 0.305: IC6.6 33.27,8.56 33.5,8.8 33.5,11.65 R16.2 R30.2 36.65,14.7 R32.1
N$48
  Top 0.305: IC6.7 30.23,9.84 29.8,9.4 29.8,5.4 31.4,3.8 39.1,3.8 39.1,9.1 37.85,10.35 R15.1 R32.2
N$49
  Top 0.508: R33.2 L2.1
N$50
  Top 0.305: -15VOK.2 80.8,12.55 R14.1
N$51
  Top 0.508: L4.1 R34.2
N$52
  Top 0.305: +15VOK.2 85.95,14.15 R29.1
N$64
  Top 0.305: VCA1(LEFT).8 69.5,49.3 69.31,49.1 69.31,46.74 60.76,38.2 51.6,38.2 50.05,39.75 50.05,41.47 48.79,42.73 IC8.2 46.37,42.65 R48.1 C55.1
N$65
  Top 0.305: VCA1(LEFT).1 66.3,52.45 R52.2
N$71  (via drill 0.35)
  Top 0.305: R52.1 v69.9,52.5 | v68,59.9 C67.-
  Bottom 0.305: v69.9,52.5 68,54.4 v68,59.9
N$72
  Top 0.305: R60.2 R59.1 96.2,39.4 98.4,41.6 98.4,56.4 91.6,63.2 91.6,63.1 C70.+
N$75  (via drill 0.35)
  Top 0.305: IC8.6 51.97,41.45 R49.1 C56.1 56.7,41.45 56.75,41.4 v62.4,41.4 | VCA2(RIGHT).8 71.5,38.7 68.8,41.4 v65.4,41.4
  Bottom 0.305: v65.4,41.4 v62.4,41.4
N$77
  Top 0.305: R51.2 71.5,28.75 VCA2(RIGHT).5 73.36,31.5 C60.1
N$78  (via drill 0.35)
  Top 0.305: C68.- 56,59.9 v56.1,60 | v55.9,37.2 56.3,36.8 60.6,36.8 64.2,40.4 66.65,40.4 R53.1
  Bottom 0.305: v56.1,60 55.9,59.8 v55.9,37.2
N$79
  Top 0.305: R53.2 66.3,38.85 VCA2(RIGHT).1
N$80
  Top 0.305: C63.1 73.45,45.49 VCA1(LEFT).5 71.5,42.65 R50.2
N$81  (via drill 0.35)
  Top 0.305: IC9.6 83.22,49.84 C59.1 v81.5,49.95 R54.1 | R56.2 84.65,39.5 84.65,40.9 | 84.65,40.9 R55.2 | 84.65,40.9 v81.5,40.9
  Bottom 0.305: v81.5,49.95 v81.5,40.9
N$82
  Top 0.305: IC9.7 84.83,48.25 C59.2 82.9,48.05 R54.2 79.9,28.2 77.6,25.9 68.9,25.9 68.1,26.7 68.1,33.6 67.67,34.03 VCA2(RIGHT).2 65.36,34.03 63.8,35.6 TP36.P$1
N$84
  Top 0.305: IC9.2 91.67,48.56 92.05,48.95 C64.1 R58.1 97.05,48.95 97.5,48.5 97.5,44.3 97.1,43.9 89.9,43.9 89.55,43.55 R61.2 R59.2
N$85
  Top 0.305: R57.2 86.65,36.4 R56.1 86.7,39.35 86.7,35.8 88.4,34.1 93.5,34.1 100.2,40.8 100.2,58.1 93.6,64.7 80.4,64.7 79.8,64.1 79.8,62.9 C69.+
N$87
  Top 0.305: R62.1 66.25,45.45 VCA1(LEFT).4
N$88
  Top 0.305: R58.2 95.9,47.25 C64.2 92.66,47.3 IC9.1 89.93,48.01 89.8,48.01 85.31,52.5 71.2,52.5 68.7,50 68.7,48.6 68.14,48.03 VCA1(LEFT).2 65.47,48.03 TP37.P$1
N$95
  Top 0.305: VCA2(RIGHT).4 63.74,31.5 R67.1
NET1
  Top 0.305: IC10.1 IC10.2 46.87,23.07 47.59,23.07 49.95,20.7 49.95,14.8 | 49.95,14.8 R17.1 | R21.1 50.05,14.7 49.95,14.8
NET2
  Top 0.305: IC10.6 IC10.7 50.16,23.73 47.5,26.4 10.3,26.4 9.95,26.05 R18.1 R26.1
NET11
  Top 0.305: IC7.2 IC7.1 8.7,27.4 61.2,27.4 72.3,16.3 72.3,14.8 72.2,14.7 | R5.1 72.2,14.7 | 72.2,14.7 R1.1
NET22
  Top 0.305: IC7.7 IC7.6 27.54,22.66 30.05,20.15 R2.1 R30.1
OUT1_DRIVER  (via drill 0.5)
  Top 0.508: R7.1 13.25,67.65 11.9,69 9.3,69 6.92,71.38 BY_1_1.2 5.58,72.6 13.3,72.6 14.52,71.38 BY_1_2.2 v19.6,71.38 20.77,71.38 24.25,67.9 R33.1 | v152.7,80 154.1,80 U12.16
  Bottom 0.508: v19.6,71.38 19.6,104.4 21.7,106.5 126.2,106.5 v152.7,80
OUT2_DRIVER  (via drill 0.5)
  Top 0.508: R34.1 49.75,67.85 48.6,69 46.9,69 44.7,71.2 v44,71.2 40.53,71.2 BY_2_2.2 38.92,71.38 37.7,72.6 29.58,72.6 BY_2_1.2 32.32,71.38 34.9,68.8 36.7,68.8 37.35,68.15 R8.1 | v150.1,81.3 150.12,81.33 U12.15
  Bottom 0.508: v44,71.2 44,103.6 45.9,105.5 125.9,105.5 v150.1,81.3
OUT3_DRIVER  (via drill 0.5)
  Top 0.508: R9.1 61.55,67.85 60.3,69.1 57.2,69.1 v56.25,70.05 54.92,71.38 K5.2 | v147.5,82.6 U12.14
  Bottom 0.508: v56.25,70.05 56.25,99.05 59.2,102 128.1,102 v147.5,82.6
OUT4_DRIVER  (via drill 0.5)
  Top 0.508: R10.1 72.45,67.9 71.55,68.8 69.6,68.8 v68.15,70.25 67.02,71.38 K6.2 | v144.8,83.9 154.12,83.9 U12.13
  Bottom 0.508: v68.15,70.25 68.15,90.25 78.7,100.8 127.9,100.8 v144.8,83.9
OUT5_DRIVER  (via drill 0.5)
  Top 0.508: K7.2 76.36,70.78 78.23,68.9 v80.6,68.9 84.3,68.9 85.45,67.75 R11.1 | v142.2,85.1 154.12,85.1 U12.12
  Bottom 0.508: v80.6,68.9 80.6,95.3 82.6,97.3 130,97.3 v142.2,85.1
OUT6_DRIVER  (via drill 0.5)
  Top 0.508: R12.1 96.65,67.9 95.65,68.9 v93.3,68.9 90.83,68.9 K8.2 | v139.6,86.4 U12.11
  Bottom 0.508: v93.3,68.9 93.3,88.9 100.6,96.2 129.8,96.2 v139.6,86.4
OUT_L/M  (via drill 0.35)
  Top 0.305: OUT_LEFT.4 44.39,55.1 85.2,55.1 v85.4,55.3 | v86.1,79 83.74,79 K7.P1
  Bottom 0.305: v86.1,79 86.1,56 v85.4,55.3
OUT_R/S  (via drill 0.35)
  Top 0.305: OUT_RIGHT.4 17.39,54.55 18.14,53.8 v96.7,53.8 | K8.P1 v98,79.1
  Bottom 0.305: v96.7,53.8 98,55.1 v98,79.1
R  (via drill 0.35)
  Top 0.305: IN_RIGHT.6 IN_RIGHT.5 v10.6,54 11.4,53.2 v53,53.2 | v54.9,76.6 54.86,76.56 K5.Q2 | v11.35,33.95 11.3,33.99 IC4.5
  Bottom 0.305: v53,53.2 53,74.7 v54.9,76.6 | v10.6,54 10.6,34.8 11.4,34 v11.35,33.95
R/S_IN(VCA2_IN)  (via drill 0.35)
  Top 0.305: K5.P2 v50.2,79.1 | v50.4,63.7 55,63.7 C68.+ 56.8,63.5 v57.6,63.5 | IC10.5 55.8,21.2 v57,22.4
  Bottom 0.305: v50.2,79.1 50.2,63.9 v50.4,63.7 | v57.6,63.5 57.6,23 v57,22.4
R/S_OUT(VCA2_OUT)  (via drill 0.35)
  Top 0.305: K6.Q2 62.06,76.56 61.25,75.75 55.45,75.75 v54.6,74.9 | IC8.7 53.69,42.73 R49.2 54.48,43.17 | C56.2 54.5,43.15 54.48,43.17 | IC1.5 11.15,46.4 11.9,45.65 v11.9,42.9 13.7,41.1 36.9,41.1 43.8,48 52.5,48 v54.48,46.02 54.48,43.17 | v16.5,21.5 11.8,21.5 IC7.5
  Bottom 0.305: v11.9,42.9 11.9,34.35 12.01,34.25 12.01,26 v16.5,21.5 | v54.6,74.9 54.6,46.15 v54.48,46.02
R/S_OUT+  (via drill 0.5)
  Top 0.305: BY_1_2.S1 23.58,81.7 v21.6,81.7 | v20.6,61.2 21.16,60.63 OUT_RIGHT.7 OUT_RIGHT.8
  Bottom 0.305: v21.6,81.7 21.4,81.5 21.4,62 v20.6,61.2
R/S_OUT-  (via drill 0.5)
  Top 0.2: v16.4,83.8 16.36,83.75 | v15.4,62 15.49,61.91 | OUT_RIGHT.1 OUT_RIGHT.2
  Top 0.305: BY_1_2.S2 16.36,83.75 | 15.49,61.91 OUT_RIGHT.1
  Bottom 0.305: v16.4,83.8 18.1,82.1 18.1,64.7 v15.4,62
RELAIS1
  Top 0.508: U12.1 160.64,77.8 161.51,76.93 U1.CN11_58
RELAIS2
  Top 0.508: U1.CN11_62 163.91,82.01 163.2,81.3 160.66,81.3 U12.2
RELAIS3
  Top 0.508: U1.CN11_64 164.95,84.55 163,82.59 U12.3
RELAIS4  (via drill 0.5)
  Top 0.508: U12.4 160.68,83.9 v162.6,83.9
  Bottom 0.508: U1.CN11_66 162.62,83.9 v162.6,83.9
RELAIS5
  Top 0.508: U12.5 159.06,85.14 158.3,85.9 158.3,91.8 162.75,96.25 169.71,96.25 170.13,95.83 170.13,88.87 U1.CN11_65
RELAIS6
  Top 0.508: U12.6 163.42,86.41 163.99,85.84 167.06,85.84 U1.CN11_63
S  (via drill 0.35)
  Top 0.305: K5.S2 50.04,81.64 v50,81.6 | v48.8,50.8 48.6,50.6 39.1,50.6 39,50.5 39,46 36.39,43.39 21.89,43.39 v21.3,42.8 | v20.6,34.6 21.3,33.9 U6.5 U6.6
  Bottom 0.305: v50,81.6 49.4,81 49.4,51.4 v48.8,50.8 | v21.3,42.8 20.6,42.1 v20.6,34.6
S1  (via drill 0.35)
  Top 0.305: K6.S2 62.52,79.8 v62.5,79.8 | U8.5 U8.6 21.04,47.66 20.3,48.4 20.3,51.6 21.2,52.5 62.3,52.5 62.5,52.7 v62.5,53.2
  Bottom 0.305: v62.5,79.8 v62.5,53.2
V+  (via drill 0.35)
  Top 0.2: 22.61,59.35 OUT_RIGHT.6
  Top 0.203: 13.09,60.63 C3.1
  Top 0.305: IN_RIGHT.7 13.09,60.63 | 22.61,59.35 C13.1 25,60.7 v25.9,61.6 | C1.1 34.62,60.65 IN_LEFT.7 | OUT_LEFT.6 48.98,59.37 C11.1 | C62.1 72.28,48.03 VCA1(LEFT).7 | IC9.8 85.15,45.7 C58.1 | C53.1 52.15,44.2 IC8.8 | IC1.8 11.64,50.2 C7.1 | C5.1 11.64,37.8 IC4.8 | U8.7 24.79,48.94 C30.1 24.85,49 v24.85,50.25 | C28.1 37.69,49.34 U7.7 | U6.7 22.52,36.45 C26.1 | U4.7 37.69,36.34 C22.1 | C23.1 11.74,25.25 IC7.8 | IC10.8 53.95,25 C32.1 | R29.2 87.85,11.35 TP09.P$1
  Top 0.508: U$1.1 157.22,2.2 U$2.1 155.95,2.45 155,3.4 v153.8,3.4
  Bottom 0.305: v25.9,61.6 25.9,51.2 24.9,50.2 v24.85,50.25
  Bottom 0.508: v153.8,3.4 152.8,3.4 150.1,0.7 107.7,0.7 101.46,6.94 89.05,6.94 CONN3.2
  pour Top: -0.9,108.8 -0.9,-1.5 96.6,-1.5 96.6,4.8 101.5,4.8 101.5,108.8
V-  (via drill 0.35, 0.5)
  Top 0.2: C2.1 27.05,58.09
  Top 0.203: C4.1 3.04,58.09 | IC1.4 2.95,46.4 C8.1 2.6,45.3 v2.5,45.2
  Top 0.305: 3.04,58.09 IN_RIGHT.4 | C4.1 v2.9,56.4 | 27.05,58.09 IN_LEFT.4 | OUT_RIGHT.5 23.25,57.45 C14.1 23.6,55.9 v24.3,56.6 | C12.1 46.6,56.85 OUT_LEFT.5 v44.7,58.09 v44.7,58.1 | R50.1 v67.9,42.5 | IC9.4 C57.1 v91.7,52.7 | R61.1 v93,42.4 | R55.1 86.55,43.65 v86.6,43.7 | IC8.4 C54.1 v45.1,38.5 | C6.1 3.06,33.99 IC4.4 4.65,33.15 v4.7,33.1 | U6.4 14.76,33.9 C25.1 v14.7,32.5 | U8.4 14.76,46.4 C29.1 v14.7,45.1 | U7.4 29.84,46.85 C27.1 v27.4,45.5 | C2.1 v27,56.9 | U4.4 27.55,33.8 C21.1 v27.5,32.1 | IC7.4 4.14,21.39 C24.1 v4.1,19.8 | IC10.4 43.66,21.2 C31.1 v43.6,20 | R51.1 69.75,27.25 v69.8,27.2 | C15.1 6.25,7.05 IC3.4 6.2,7 v6.2,6 | C19.1 26.25,6.95 IC6.4 26.3,7 v26.3,5.9 | C9.1 43.55,7.29 IC2.4 45.8,6.89 v45.8,6 | C17.1 63.24,7.29 IC5.4 v66.1,5.5 | -15VOK.1 83.9,14.3 84.7,13.5 84.7,10.8 84.3,10.4 TP23.P$1
  pour midBottom: -1.6,109.3 -1.6,-2.1 96.6,-2.1 96.6,4.7 101.5,4.7 101.5,109.3

## Text on the board
tNames: AGND | -15V | +15V | AGND | R/S IN | R/S OUT | L/M IN | L/M OUT | DGND